# EasyEDA Pro project GuaiZhang.eprj

# Schematic ZhiGuai
Board Name: Board1; Create Date: 2024-12-08; Page Name: P1; Project Name: GuaiZhang; Schematic Name: ZhiGuai; Update Date: 2024-12-08; Company: 嘉立创EDA; Page Size: A4; Version: V1.0
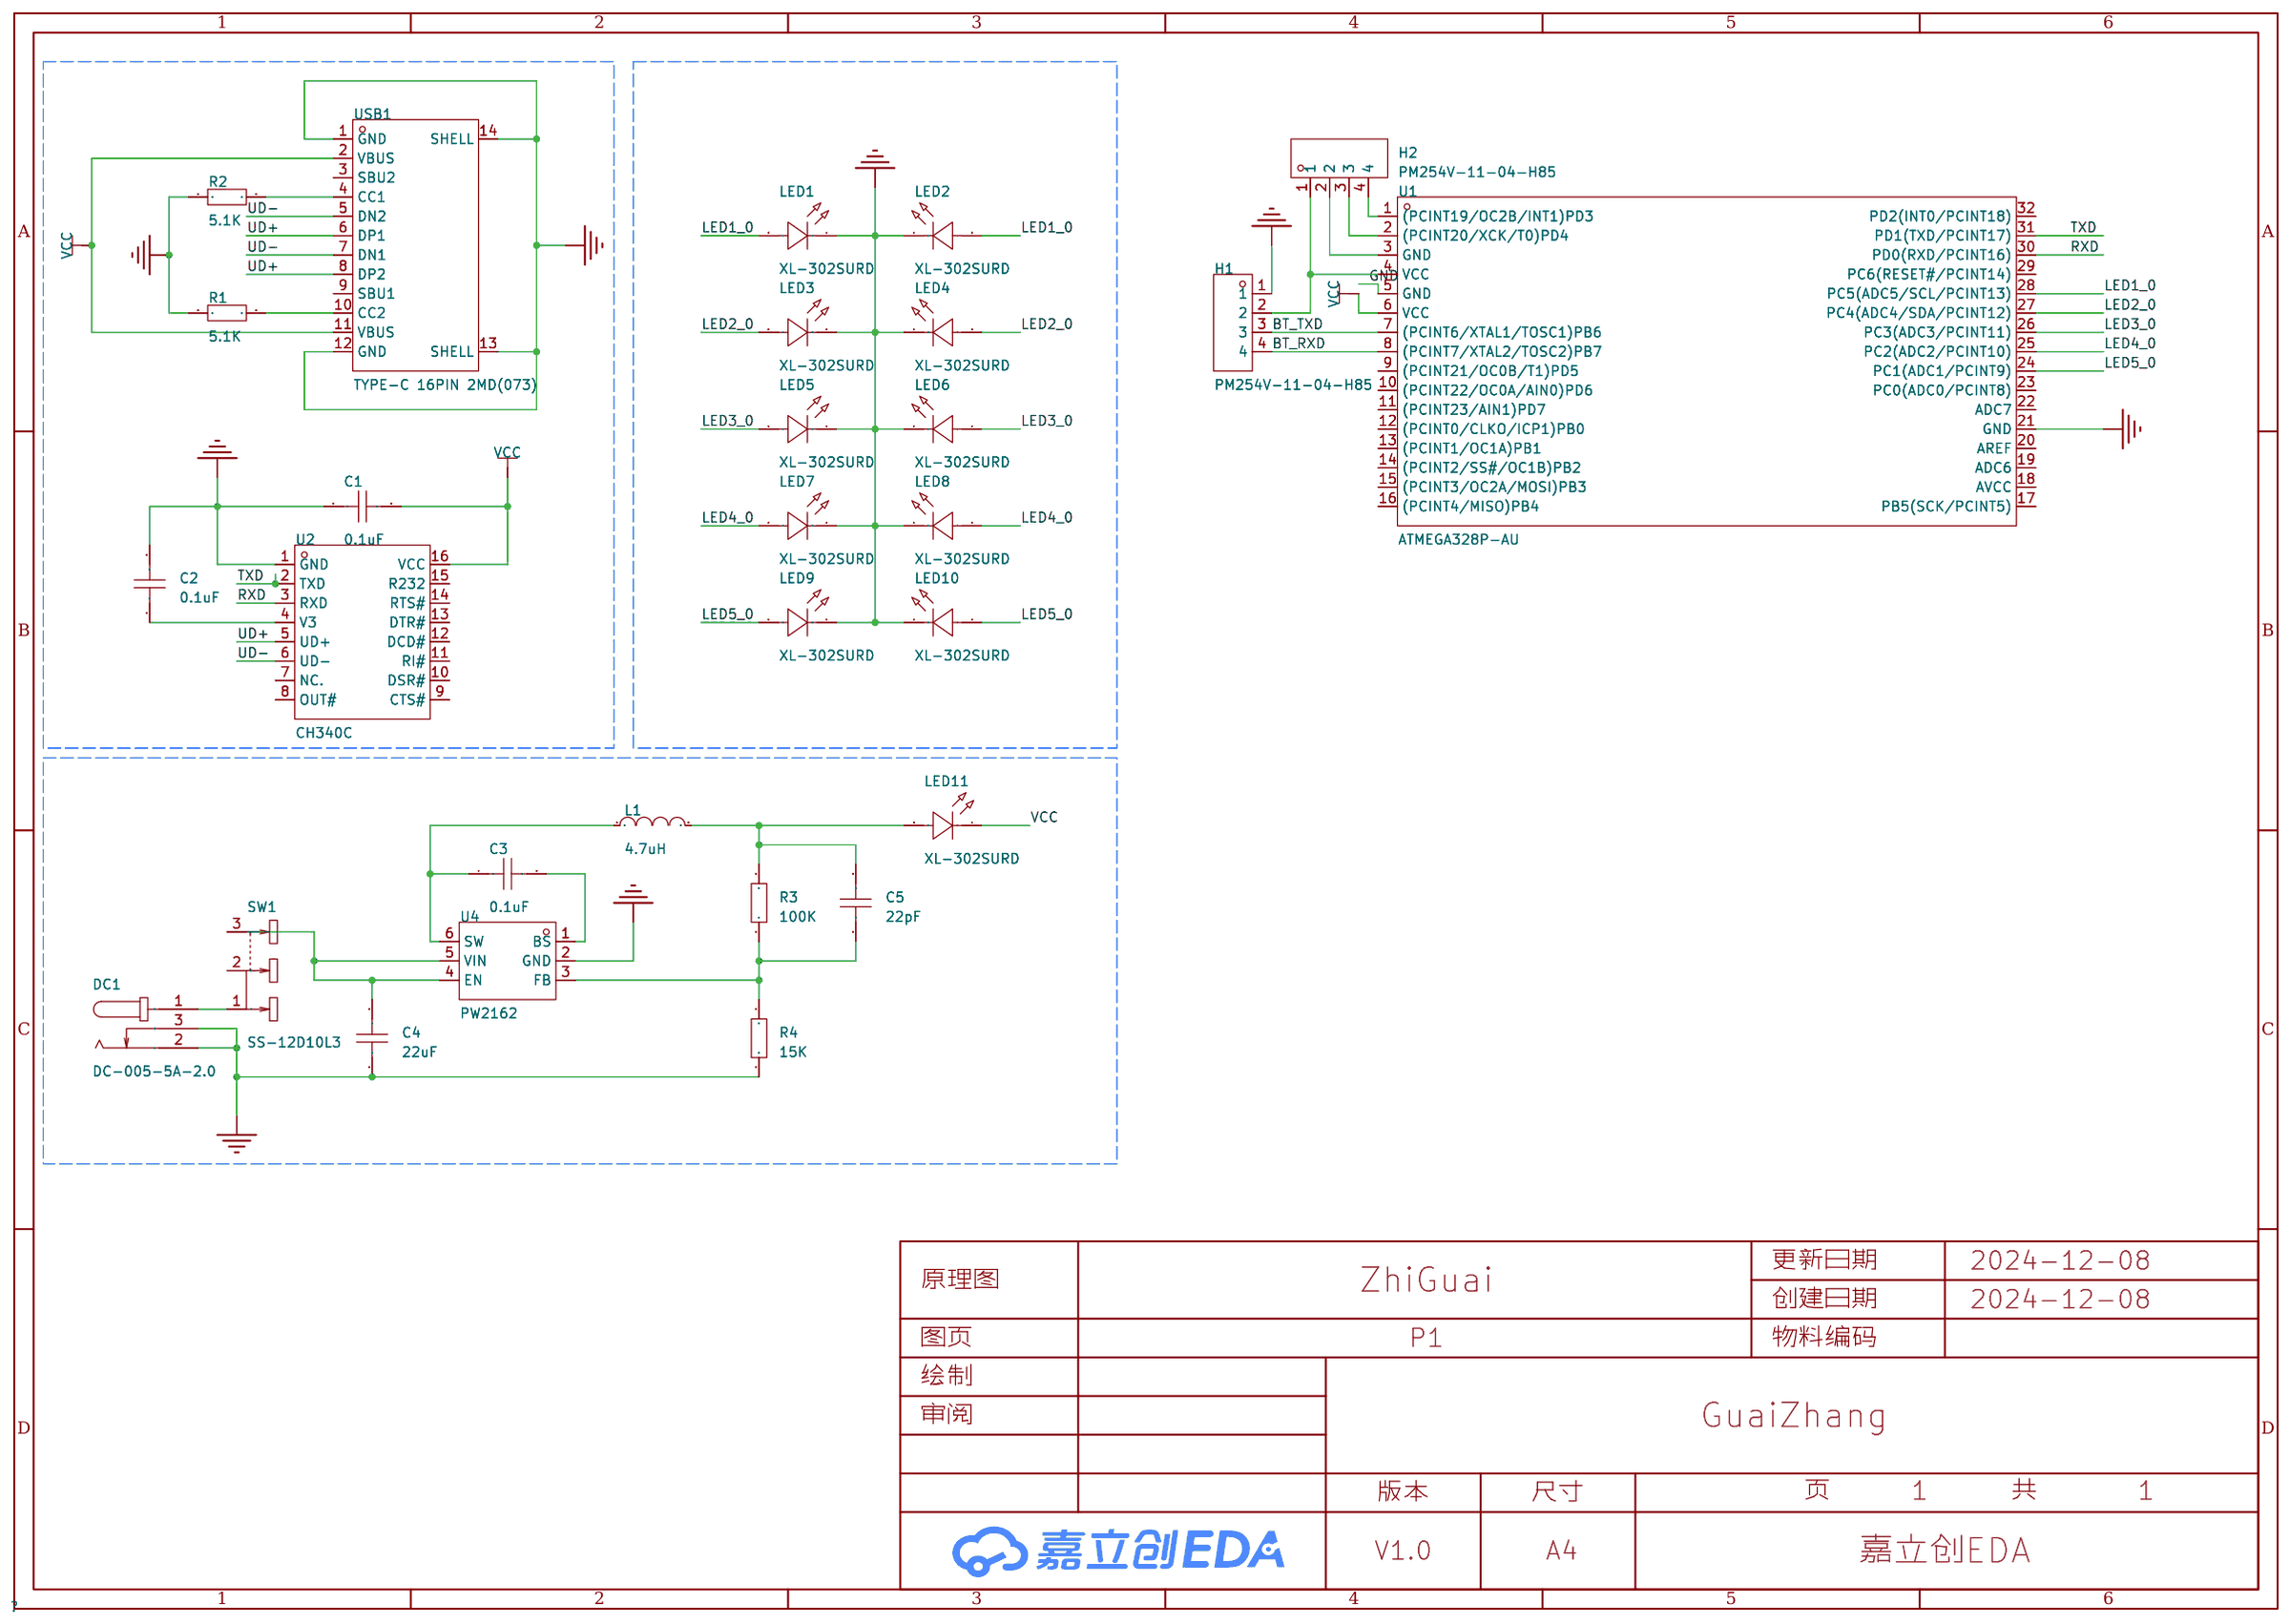
[diagram p0: schematic sheet]

## Parts
C1  0.1uF  [C0603]
C2  0.1uF  [C0603]
C3  0.1uF  [C0603]
C4  22uF  [C0603]
C5  22pF  [C0603]
DC1  DC-005-5A-2.0  [DC-IN-TH_DC-005-5A-2.0]
H1  PM254V-11-04-H85  [HDR-TH_4P-P2.54-V-F]
H2  PM254V-11-04-H85  [HDR-TH_4P-P2.54-V-F]
L1  4.7uH  [L0603]
LED1  XL-302SURD  [LED-TH_BD3.8-P2.54-RD]
LED2  XL-302SURD  [LED-TH_BD3.8-P2.54-RD]
LED3  XL-302SURD  [LED-TH_BD3.8-P2.54-RD]
LED4  XL-302SURD  [LED-TH_BD3.8-P2.54-RD]
LED5  XL-302SURD  [LED-TH_BD3.8-P2.54-RD]
LED6  XL-302SURD  [LED-TH_BD3.8-P2.54-RD]
LED7  XL-302SURD  [LED-TH_BD3.8-P2.54-RD]
LED8  XL-302SURD  [LED-TH_BD3.8-P2.54-RD]
LED9  XL-302SURD  [LED-TH_BD3.8-P2.54-RD]
LED10  XL-302SURD  [LED-TH_BD3.8-P2.54-RD]
LED11  XL-302SURD  [LED-TH_BD3.8-P2.54-RD]
R1  5.1K  [R0603]
R2  5.1K  [R0603]
R3  100K  [R0603]
R4  15K  [R0603]
SW1  SS-12D10L3  [SW-TH_SS-12D10L3]
U1  ATMEGA328P-AU  [TQFP-32_L7.0-W7.0-P0.80-LS9.0-BL]
U2  CH340C  [SOP-16_L10.0-W3.9-P1.27-LS6.0-BL]
U4  PW2162  [SOT-23-6_L2.9-W1.6-P0.95-LS2.8-BL]
USB1  TYPE-C 16PIN 2MD(073)  [USB-C-SMD_TYPE-C-6PIN-2MD-073]

## Library data of the parts
C1-C5 = CAP_0603: Supplier Footprint: 0603
DC1 = DC-005-5A-2.0: LCSC Part Name: DC电源插座 内径:2mm 外径:6.2mm; Supplier Part: C381116; Manufacturer: XKB Connection(中国星坤); Supplier Footprint: 插件; JLCPCB Part Class: 扩展库; Datasheet: https://atta.szlcsc.com/upload/public/pdf/source/20211015/707A35F7AB6E89C57AAB641950105BB7.pdf; Supplier: LCSC; Connector Type: DC电源插座; Mounting Style: 弯插; Inside Contact Diameter: 2mm; Outside Contact Diameter: 6.2mm; Current Rating (Max): 5A; Voltage Rating (Max): 24V; Operating Temperature Range: -20℃~+70℃
H1 H2 = PM254V-11-04-H85: LCSC Part Name: 间距:2.54mm 1x4P 直插; Supplier Part: C541851; Manufacturer: XFCN(兴飞); Supplier Footprint: 插件,P=2.54mm; JLCPCB Part Class: 扩展库; Datasheet: https://atta.szlcsc.com/upload/public/pdf/source/20200518/C541849_85853D71FC67C51915A806977A588FDA.pdf; Supplier: LCSC; Holes Structure: 1x4P; Pitch: 2.54mm; Mounting Type: 直插; Number of Rows: 单排; Number of Holes: 4P; Contact Material: 黄铜
L1 = L_0603
LED1-LED11 = XL-302SURD: Supplier Part: C2895470; Manufacturer: XINGLIGHT(成兴光); Supplier Footprint: 插件,D=3mm; JLCPCB Part Class: 扩展库; Datasheet: https://atta.szlcsc.com/upload/public/pdf/source/20240112/E1E2B82945FD635E4907401DDE6D4922.pdf; Supplier: LCSC; Lamp Holder Type: 3mm圆形灯头; Emitted Color: 红色; Power Dissipation: 80mW; Forward Current: 30mA; Dominant Wavelength: 615nm~620nm; Peak Wavelength: 625nm; Lens Color: 红色透镜; Viewing Angle: 50°; Operating Temperature: -25℃~+85℃
R1-R4 = Res_0603: Supplier Footprint: 0603
SW1 = SS-12D10L3: LCSC Part Name: 柄长3mm 直插双档 滑动开关; Supplier Part: C319013; Manufacturer: XKB Connectivity(中国星坤); Supplier Footprint: 插件; JLCPCB Part Class: 扩展库; Datasheet: https://atta.szlcsc.com/upload/public/pdf/source/20211009/D6412F37AABE6F9459A6EE7FA4DAEADB.pdf; Supplier: LCSC; Circuit: 单刀双掷; Actuator Style: 矩形柱状; Pin Style: PC引脚; Switch Length: 13mm; Switch Width: 6.8mm; Switch Height: 6.4mm; Mounting Style: 直插; Actuator Color: 黑色; Current Rating (DC): 3A; Voltage Rating (DC): 125V; Current Rating (AC): 3A; Voltage Rating (AC): 125V; Mechanical Life: 1万次; Operating Temperature: -40℃~+85℃
U1 = ATMEGA328P-AU: LCSC Part Name: 基于AVR增强型RISC架构的低功耗CMOS 8位微控制器; Supplier Part: C14877; Manufacturer: MICROCHIP(美国微芯); Supplier Footprint: TQFP-32(7x7); JLCPCB Part Class: 扩展库; Datasheet: https://atta.szlcsc.com/upload/public/pdf/source/20140621/1457707095197.pdf; Supplier: LCSC; CPU Core: AVR; Program Storage Size: 32KB; RAM Size: 2KB; GPIO Ports Number: 23; Operating Voltage Range: 1.8V~5.5V; CPU Maximum Speed: 20MHz; Program Memory Type: FLASH; EEPROM: 1KB; Operating Temperature Range: -40℃~+85℃; ADC (Bit): 10bit; Peripheral/Function: 看门狗；PWM；看门狗；PWM; Watchdog: 有; Low-Voltage Detect: 有; Internal Oscillator: 有
U2 = CH340C_C7464026: LCSC Part Name: USB转串口芯片CH340 （SMT编带）人工转编带; Supplier Part: C7464026; Manufacturer: WCH(南京沁恒); Supplier Footprint: SOP-16; JLCPCB Part Class: 扩展库; Datasheet: https://atta.szlcsc.com/upload/public/pdf/source/20240313/5317E2D327EA4519FF5E497C9A5C211A.pdf; Supplier: LCSC
U4 = PW2162: Supplier Part: C9900006107; Supplier Footprint: SOT-23-6L; JLCPCB Part Class: 扩展库; Supplier: LCSC
USB1 = TYPE-C 16PIN 2MD(073): LCSC Part Name: Type-C 母 卧贴; Supplier Part: C2765186; Manufacturer: SHOU HAN(首韩); Supplier Footprint: SMD; JLCPCB Part Class: 扩展库; Datasheet: https://atta.szlcsc.com/upload/public/pdf/source/20211123/39B17C16241EAC15C5E277BDA434118E.pdf; Supplier: LCSC; Connector Type: Type-C; Standard: USB 3.1; Gender: 母; Mounting Style: 卧贴; Number of Contacts: 16P; Number of Ports: 1; Current Rating - Power (Max): 5A; Operating Temperature Range: -25℃~+85℃; Rated Voltage (Max): 5V; Connect-Disconnect Life: 5千次; Core Colour: 黑色

## Nets
GND: C1.1 C2.2 C4.1 DC1.2 DC1.3 H1.1 LED1.1(K) LED2.1(K) LED3.1(K) LED4.1(K) LED5.1(K) LED6.1(K) LED7.1(K) LED8.1(K) LED9.1(K) LED10.1(K) R1.1 R2.1 R4.1 U1.5(GND) U1.21(GND) U2.1(GND) U4.2(GND) USB1.1(GND) USB1.12(GND) USB1.13(SHELL) USB1.14(SHELL)
VCC: C1.2 LED11.1(K) U1.6(VCC) U2.16(VCC) USB1.2(VBUS) USB1.11(VBUS)
BT_RXD: H1.4 U1.8((PCINT7/XTAL2/TOSC2)PB7)
BT_TXD: H1.3 U1.7((PCINT6/XTAL1/TOSC1)PB6)
LED1_0: LED1.2(A) LED2.2(A) U1.28(PC5(ADC5/SCL/PCINT13))
LED2_0: LED3.2(A) LED4.2(A) U1.27(PC4(ADC4/SDA/PCINT12))
LED3_0: LED5.2(A) LED6.2(A) U1.26(PC3(ADC3/PCINT11))
LED4_0: LED7.2(A) LED8.2(A) U1.25(PC2(ADC2/PCINT10))
LED5_0: LED9.2(A) LED10.2(A) U1.24(PC1(ADC1/PCINT9))
RXD: U1.30(PD0(RXD/PCINT16)) U2.3(RXD)
TXD: U1.31(PD1(TXD/PCINT17)) U2.2(TXD)
UD+: U2.5(UD+) USB1.6(DP1) USB1.8(DP2)
UD-: U2.6(UD-) USB1.5(DN2) USB1.7(DN1)
$1N1037: R2.2 USB1.4(CC1)
$1N1041: R1.2 USB1.10(CC2)
$1N1219: C2.1 U2.4(V3)
$1N2799: DC1.1 SW1.1
$1N3010: C4.2 SW1.3 U4.4(EN) U4.5(VIN)
$1N3028: C3.1 L1.1 U4.6(SW)
$1N3066: C3.2 U4.1(BS)
$1N3274: C5.1 R3.1 R4.2 U4.3(FB)
$1N3326: C5.2 L1.2 LED11.2(A) R3.2
$1N3504: H1.2 H2.1 U1.4(VCC)
$1N3509: H2.2 U1.3(GND)
$1N3515: H2.3 U1.2((PCINT20/XCK/T0)PD4)
$1N3521: H2.4 U1.1((PCINT19/OC2B/INT1)PD3)

Not connected (* = marked no-connect by the designer): SW1 2; U1 9((PCINT21/OC0B/T1)PD5) 10((PCINT22/OC0A/AIN0)PD6) 11((PCINT23/AIN1)PD7) 12((PCINT0/CLKO/ICP1)PB0) 13((PCINT1/OC1A)PB1) 14((PCINT2/SS#/OC1B)PB2) 15((PCINT3/OC2A/MOSI)PB3) 16((PCINT4/MISO)PB4) 17(PB5(SCK/PCINT5)) 18(AVCC) 19(ADC6) 20(AREF) 22(ADC7) 23(PC0(ADC0/PCINT8)) 29(PC6(RESET#/PCINT14)) 32(PD2(INT0/PCINT18)); U2 7(NC.) 8(OUT#) 9(CTS#) 10(DSR#) 11(RI#) 12(DCD#) 13(DTR#) 14(RTS#) 15(R232); USB1 3(SBU2) 9(SBU1)

# Board 1
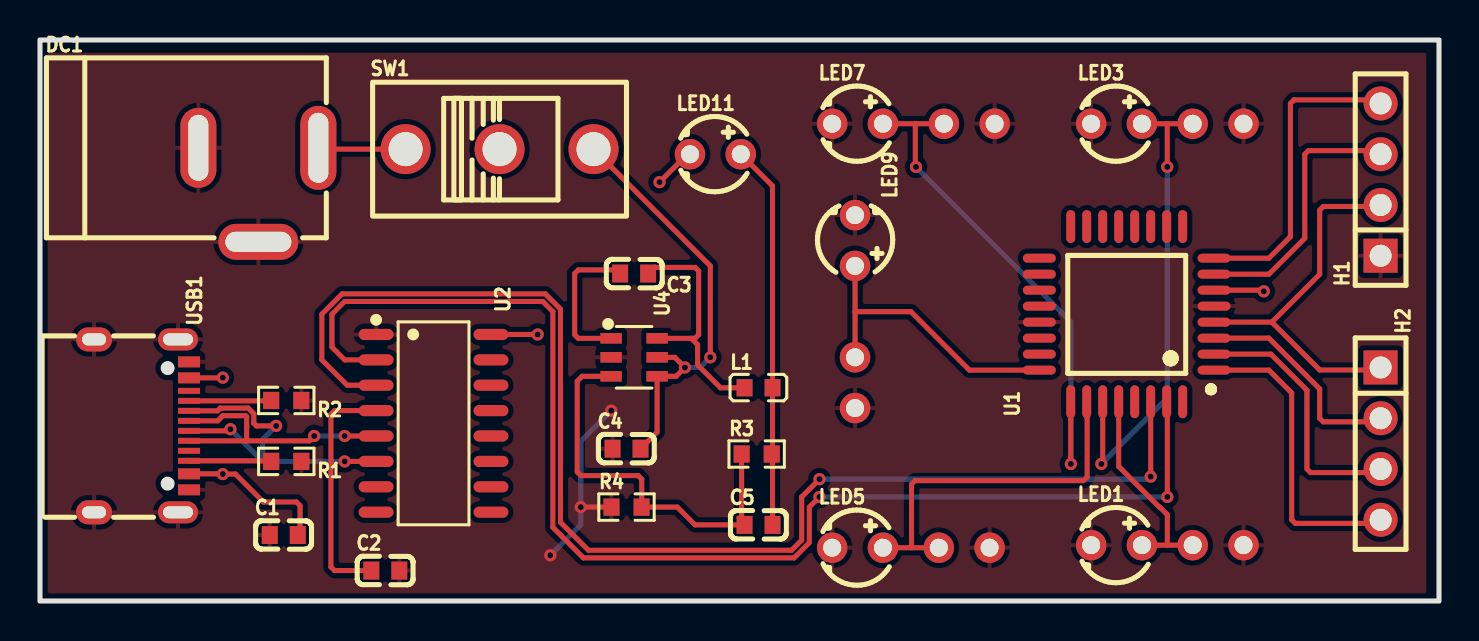
[diagram p1: board, top side]
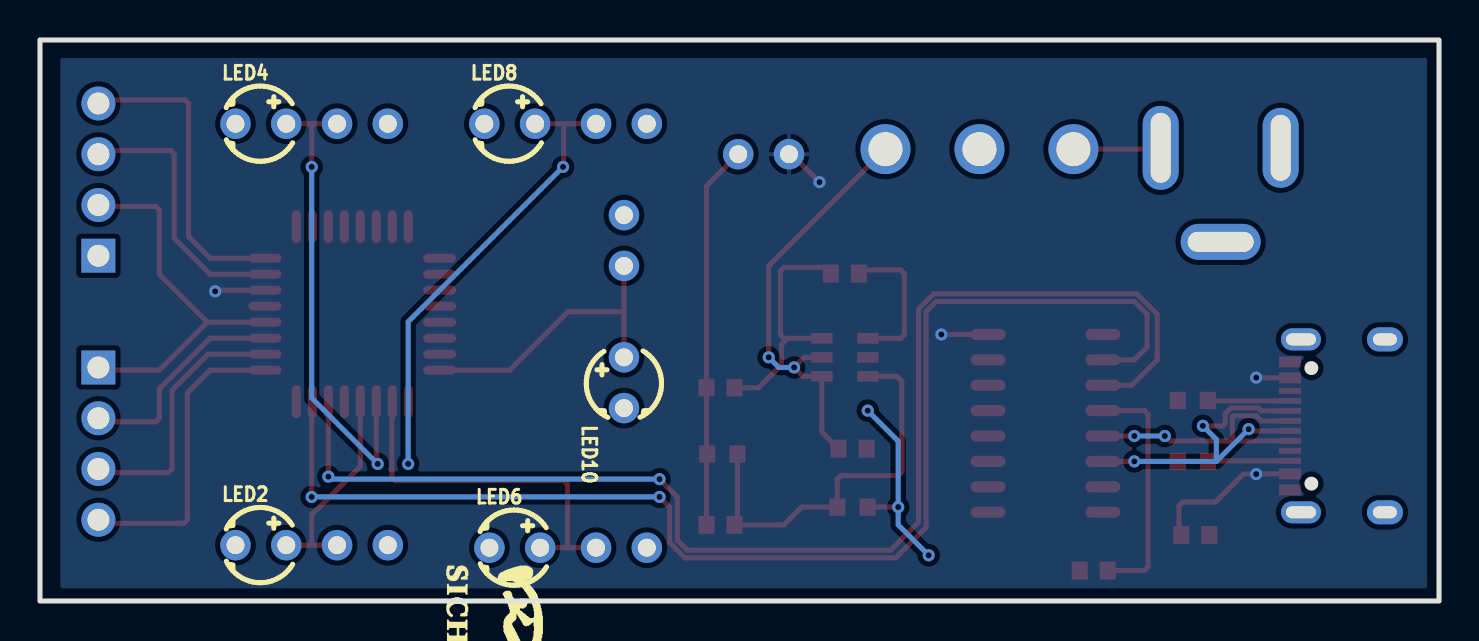
[diagram p2: board, bottom side, seen from below]

Outline 69.98 x 28.07 mm; copper layers: Top Layer, Bottom Layer. Coordinates in mm from the lower left corner of the outline.
Outline path: rectangle 0,28.07 69.98,0
Stack: Top Layer 0.035mm / Dielectric1 1.51mm FR4 er 4.5 / Bottom Layer 0.035mm

## Design rules (mm)
template: JLCPCB Capability(Two Layers Board)
spacing copperThickness1oz (default): track to track 0.102, other pairs 0.152 to 0.3
spacing copperThickness2oz: track to track 0.203, other pairs 0.152 to 0.3
track width copperThickness1oz (default): min 0.127, default 0.254, max 2.54
track width copperThickness2oz: min 0.203, default 0.254, max 2.54
differential pair differentialPair (default): width min 0.127, default 0.254, max 2.54; gap min 0.152, default 0.152
via viaSize (default): diameter min 0.5, default 0.61, max 10; hole min 0.3, default 0.305, max 6.3

## Placement (name value [footprint] x y rotation side)
C1  0.1uF  [C0603]  12.19 3.3 0 top
C2  0.1uF  [C0603]  17.27 1.52 0 top
C3  0.1uF  [C0603]  29.72 16.38 180 top
C4  22uF  [C0603]  29.34 7.62 0 top
C5  22pF  [C0603]  35.94 3.81 0 top
DC1  DC-005-5A-2.0  [DC-IN-TH_DC-005-5A-2.0]  10.92 20.32 0 top
H1  PM254V-11-04-H85  [HDR-TH_4P-P2.54-V-F]  67.06 21.08 90 top
H2  PM254V-11-04-H85  [HDR-TH_4P-P2.54-V-F]  67.06 7.87 270 top
L1  4.7uH  [L0603]  35.94 10.67 0 top
LED1  XL-302SURD  [LED-TH_BD3.8-P2.54-RD]  53.85 2.79 0 top
LED2  XL-302SURD  [LED-TH_BD3.8-P2.54-RD]  58.93 2.79 180 bottom
LED3  XL-302SURD  [LED-TH_BD3.8-P2.54-RD]  53.85 23.88 0 top
LED4  XL-302SURD  [LED-TH_BD3.8-P2.54-RD]  58.93 23.88 180 bottom
LED5  XL-302SURD  [LED-TH_BD3.8-P2.54-RD]  40.89 2.67 0 top
LED6  XL-302SURD  [LED-TH_BD3.8-P2.54-RD]  46.23 2.67 180 bottom
LED7  XL-302SURD  [LED-TH_BD3.8-P2.54-RD]  40.89 23.88 0 top
LED8  XL-302SURD  [LED-TH_BD3.8-P2.54-RD]  46.48 23.88 180 bottom
LED9  XL-302SURD  [LED-TH_BD3.8-P2.54-RD]  40.77 18.03 270 top
LED10  XL-302SURD  [LED-TH_BD3.8-P2.54-RD]  40.77 10.92 90 bottom
LED11  XL-302SURD  [LED-TH_BD3.8-P2.54-RD]  33.78 22.35 0 top
R1  5.1K  [R0603]  12.32 6.98 180 top
R2  5.1K  [R0603]  12.32 10.03 180 top
R3  100K  [R0603]  35.85 7.35 0 top
R4  15K  [R0603]  29.34 4.7 0 top
SW1  SS-12D10L3  [SW-TH_SS-12D10L3]  22.99 22.61 0 top
U1  ATMEGA328P-AU  [TQFP-32_L7.0-W7.0-P0.80-LS9.0-BL]  54.36 14.35 90 top
U2  CH340C  [SOP-16_L10.0-W3.9-P1.27-LS6.0-BL]  19.69 8.89 270 top
U4  PW2162  [SOT-23-6_L2.9-W1.6-P0.95-LS2.8-BL]  29.72 12.19 270 top
USB1  TYPE-C 16PIN 2MD(073)  [USB-C-SMD_TYPE-C-6PIN-2MD-073]  5.08 8.76 270 top

## Footprints (pads in the part's own frame, mm; a bottom-side part is the same pattern mirrored in y, then rotated)
C0603
  rect 0.8x0.9 smd: 1(-0.7,0) 2(0.7,0)
DC-IN-TH_DC-005-5A-2.0
  oval 1.8x4.2 hole 1x3.5: 1(3,2.352)
  oval 1.8x4 hole 1x3.3: 2(-3,2.352)
  oval 4x1.8 hole 3.3x1: 3(-0.001,-2.352)
HDR-TH_4P-P2.54-V-F
  rect 1.7x1.7 hole 1.1: 1(-3.81,0)
  round 1.7 hole 1.1: 2(-1.27,0) 3(1.27,0) 4(3.81,0)
L0603
  rect 0.8x0.864 smd: 1(-0.7,0) 2(0.7,0)
LED-TH_BD3.8-P2.54-RD
  round 1.524 hole 0.9: 1(-1.27,0) 2(1.27,0)
R0603
  rect 0.806x0.864 smd: 1(-0.753,0) 2(0.753,0)
SOP-16_L10.0-W3.9-P1.27-LS6.0-BL
  oval 0.56x1.745 smd: 1(-4.445,-2.873) 2(-3.175,-2.873) 3(-1.905,-2.873) 4(-0.635,-2.873) 5(0.635,-2.873) 6(1.905,-2.873) 7(3.175,-2.873) 8(4.445,-2.873) 9(4.445,2.873) 10(3.175,2.873) 11(1.905,2.873) 12(0.635,2.873) 13(-0.635,2.873) 14(-1.905,2.873) 15(-3.175,2.873) 16(-4.445,2.873)
SOT-23-6_L2.9-W1.6-P0.95-LS2.8-BL
  rect 0.532x1.072 smd: 1(-0.95,-1.149) 2(0,-1.149) 3(0.95,-1.149) 4(0.95,1.149) 5(0,1.149) 6(-0.95,1.149)
SW-TH_SS-12D10L3
  round 2.5 hole 1.7: 1(-4.7,0) 2(0,0) 3(4.7,0)
TQFP-32_L7.0-W7.0-P0.80-LS9.0-BL
  oval 0.45x1.65 smd: 1(-2.8,-4.369) 2(-2,-4.369) 3(-1.2,-4.369) 4(-0.4,-4.369) 5(0.4,-4.369) 6(1.2,-4.369) 7(2,-4.369) 8(2.8,-4.369) 17(2.8,4.369) 18(2,4.369) 19(1.2,4.369) 20(0.4,4.369) 21(-0.4,4.369) 22(-1.2,4.369) 23(-2,4.369) 24(-2.8,4.369)
  oval 1.65x0.45 smd: 9(4.381,-2.8) 10(4.381,-2) 11(4.381,-1.2) 12(4.381,-0.4) 13(4.381,0.4) 14(4.381,1.2) 15(4.381,2) 16(4.381,2.8) 25(-4.381,2.8) 26(-4.381,2) 27(-4.381,1.2) 28(-4.381,0.4) 29(-4.381,-0.4) 30(-4.381,-1.2) 31(-4.381,-2) 32(-4.381,-2.8)
USB-C-SMD_TYPE-C-6PIN-2MD-073
  rect 0.55x1.1 smd: 1(-3.2,2.375) 2(-2.4,2.375) 11(2.4,2.375) 12(3.2,2.375)
  rect 0.3x1.1 smd: 3(-1.75,2.375) 4(-1.25,2.375) 5(-0.75,2.375) 6(-0.25,2.375) 7(0.25,2.375) 8(0.75,2.375) 9(1.25,2.375) 10(1.75,2.375)
  oval 1.1x2 hole 0.6x1.5: 13(-4.325,1.825) 14(4.325,1.825)
  oval 1.2x1.8 hole 0.6x1.2: 13(-4.325,-2.375) 14(4.325,-2.375)

## Nets
As in the schematic.

Pads without a net: SW1 2; U1 9 10 11 12 13 14 15 16 17 18 19 20 22 23 29 32; U2 7 8 9 10 11 12 13 14 15; USB1 3 9

## Via types
v1: diameter 0.61, hole 0.305, Top Layer to Bottom Layer, 23 vias

## Routing (per net, layer and track width the routed paths; a pad name or vN(x,y) marks a point on that pad's centre or on a via; arc(x,y) is an arc through that point)
GND: length 10
  Top Layer w0.254: v1(27.05,4.7) R4.1
  Bottom Layer w0.254: v1(25.53,2.29) 27.05,3.81 v1(27.05,4.7) 27.05,8 v1(28.57,9.52)
VCC: length 16.4
  Top Layer w0.254: C1.2 13.01,3.42 13.01,4.77 12.83,4.95 11.18,4.95 9.78,6.35 v1(9.14,6.35) 9.13,6.36 USB1.11 ; LED11.1 32.38,22.35 v1(30.99,20.95) ; v1(61.21,15.49) 61.16,15.55 58.72,15.55 ; v1(9.14,11.18) 9.13,11.16 USB1.2 ; U2.16 v1(24.89,13.33)
BT_RXD: length 15.6
  Top Layer w0.254: H1.4 66.88,25.07 62.72,25.07 62.54,24.89 62.54,18.23 61.47,17.15 U1.8
BT_TXD: length 13.4
  Top Layer w0.254: U1.7 61.47,16.35 63.26,18.14 63.26,22.35 63.44,22.53 66.88,22.53 H1.3
LED1_0: length 11
  Top Layer w0.254: 56.39,2.79 LED2.2 57.91,2.79 ; 56.39,2.79 56.39,4.32 56.01,4.7 55.99,4.7 53.96,6.73 U1.28 ; 56.39,2.79 LED1.2
LED2_0: length 24.1
  Top Layer w0.254: 56.38,23.88 v1(56.38,21.72) ; 56.38,23.88 LED3.2 ; 56.38,23.88 LED4.2 ; U1.27 53.16,6.93 v1(53.09,6.86)
  Bottom Layer w0.254: v1(53.09,6.86) 56.38,10.16 v1(56.38,21.72)
LED3_0: length 18.7
  Top Layer w0.254: LED5.2 43.59,2.67 ; 43.59,2.67 43.59,5.84 43.77,6.02 52.2,6.02 52.38,6.2 52.38,9.19 52.36,9.21 U1.26 ; 43.59,2.67 LED6.2
LED4_0: length 26.4
  Top Layer w0.254: U1.25 51.56,6.86 v1(51.56,6.86) ; LED7.2 43.78,23.88 ; 43.78,23.88 43.78,21.75 v1(43.81,21.72) ; 43.78,23.88 LED8.2
  Bottom Layer w0.254: v1(43.81,21.72) 51.56,13.97 v1(51.56,6.86)
LED5_0: length 15
  Top Layer w0.254: 40.77,14.47 43.56,14.47 46.49,11.55 49.99,11.55 ; 40.77,14.47 LED10.2 ; 40.77,14.47 LED9.2
RXD: length 65.5
  Top Layer w0.254: U1.30 55.56,6.22 v1(55.55,6.22) ; U2.3 15.37,10.79 14.1,12.06 14.1,14.35 15.11,15.37 25.27,15.37 26.03,14.6 26.03,3.94 27.43,2.54 37.59,2.54 38.1,3.05 38.1,5.21 v1(38.99,6.1)
  Bottom Layer w0.254: v1(55.55,6.22) 55.43,6.1 v1(38.99,6.1)
TXD: length 64.9
  Top Layer w0.254: U2.2 15.24,12.06 14.6,12.7 14.6,14.35 15.24,14.99 25.15,14.99 25.65,14.48 25.65,3.68 27.18,2.16 37.72,2.16 38.48,2.92 38.48,4.7 v1(38.99,5.21) ; U1.31 56.39,9.94 v1(56.39,5.21)
  Bottom Layer w0.254: v1(38.99,5.21) v1(56.39,5.21)
UD+: length 13.7
  Top Layer w0.254: 10.34,8.01 13.47,8.01 v1(13.72,8.25) ; 10.34,8.01 10.34,8.71 10.34,8.71 10.34,9.22 10.29,9.27 9.14,9.27 8.89,9.01 USB1.6 ; 10.34,8.01 USB1.8 ; v1(15.24,8.25) U2.5
  Bottom Layer w0.254: v1(13.72,8.25) v1(15.24,8.25)
UD-: length 17.2
  Top Layer w0.254: USB1.7 9.44,8.51 v1(9.52,8.6) ; U2.6 v1(15.24,6.98) ; v1(11.81,8.76) 11.81,8.76 10.83,8.76 10.7,8.89 10.7,9.37 10.41,9.65 9.02,9.65 8.88,9.51 USB1.5
  Bottom Layer w0.254: v1(11.81,8.76) 11.14,8.09 11.14,6.98 ; 11.14,6.98 v1(9.52,8.6) ; 11.14,6.98 v1(15.24,6.98)
$1N1037: length 4.1
  Top Layer w0.254: USB1.4 11.55,10.01 R2.2
$1N1041: length 4.1
  Top Layer w0.254: USB1.10 11.54,7.01 R1.2
$1N1219: length 12.1
  Top Layer w0.254: U2.4 14.73,9.52 14.55,9.35 14.55,1.7 14.73,1.52 C2.1
$1N2799: length 4.4
  Top Layer w0.254: DC1.1 13.99,22.61 SW1.1
$1N3010: length 21.5
  Top Layer w0.254: 30.04,7.62 30.87,8.45 U4.4 31.82,11.24 v1(32.26,11.68) 31.75,12.19 U4.5 ; SW1.3 33.53,16.77 v1(33.53,12.19)
  Bottom Layer w0.254: v1(33.53,12.19) 33.02,11.68 v1(32.26,11.68)
$1N3028: length 12.4
  Top Layer w0.254: U4.6 32.58,13.14 ; 32.58,13.14 32.77,13.14 32.95,13.32 32.95,16.51 32.77,16.69 30.72,16.69 C3.1 ; 32.58,13.14 32.89,12.83 32.89,11.81 34.04,10.67 L1.1
$1N3066: length 7.4
  Top Layer w0.254: C3.2 28.84,16.56 26.92,16.56 26.74,16.38 26.74,13.32 26.92,13.14 U4.1
$1N3274: length 20.2
  Top Layer w0.254: U4.3 27.12,11.24 26.87,11 26.87,6.45 27.05,6.28 29.92,6.28 30.1,6.1 30.1,4.71 R4.2 31.88,4.7 32.77,3.81 C5.1 35.09,3.96 R3.1
$1N3326: length 19.3
  Top Layer w0.254: C5.2 36.64,7.31 ; 36.64,7.31 R3.2 ; 36.64,7.31 L1.2 36.64,20.76 LED11.2
$1N3504: length 19.1
  Top Layer w0.254: U1.4 61.61,13.95 ; 61.61,13.95 64.01,11.56 66.93,11.56 H2.1 ; 61.61,13.95 64.01,16.34 64.01,19.56 64.19,19.74 66.98,19.74 H1.2
$1N3509: length 11
  Top Layer w0.254: H2.2 66.88,8.96 64.19,8.96 64.01,9.14 64.01,10.61 61.47,13.15 U1.3
$1N3515: length 13.2
  Top Layer w0.254: H2.3 66.88,6.42 63.55,6.42 63.37,6.6 63.37,10.54 61.56,12.35 U1.2
$1N3521: length 15.3
  Top Layer w0.254: 58.72,11.55 61.47,11.55 62.61,10.41 62.61,4.06 62.79,3.88 66.88,3.88 H2.4

## Copper pours and planes (outline as drawn; the poured copper is in the pictures)
GND on Top Layer: 0.38,27.43 69.34,27.43 69.34,0.38 0.38,0.38
VCC on Bottom Layer: 0.6,27.17 68.96,27.17 68.96,0.63 0.6,0.63
